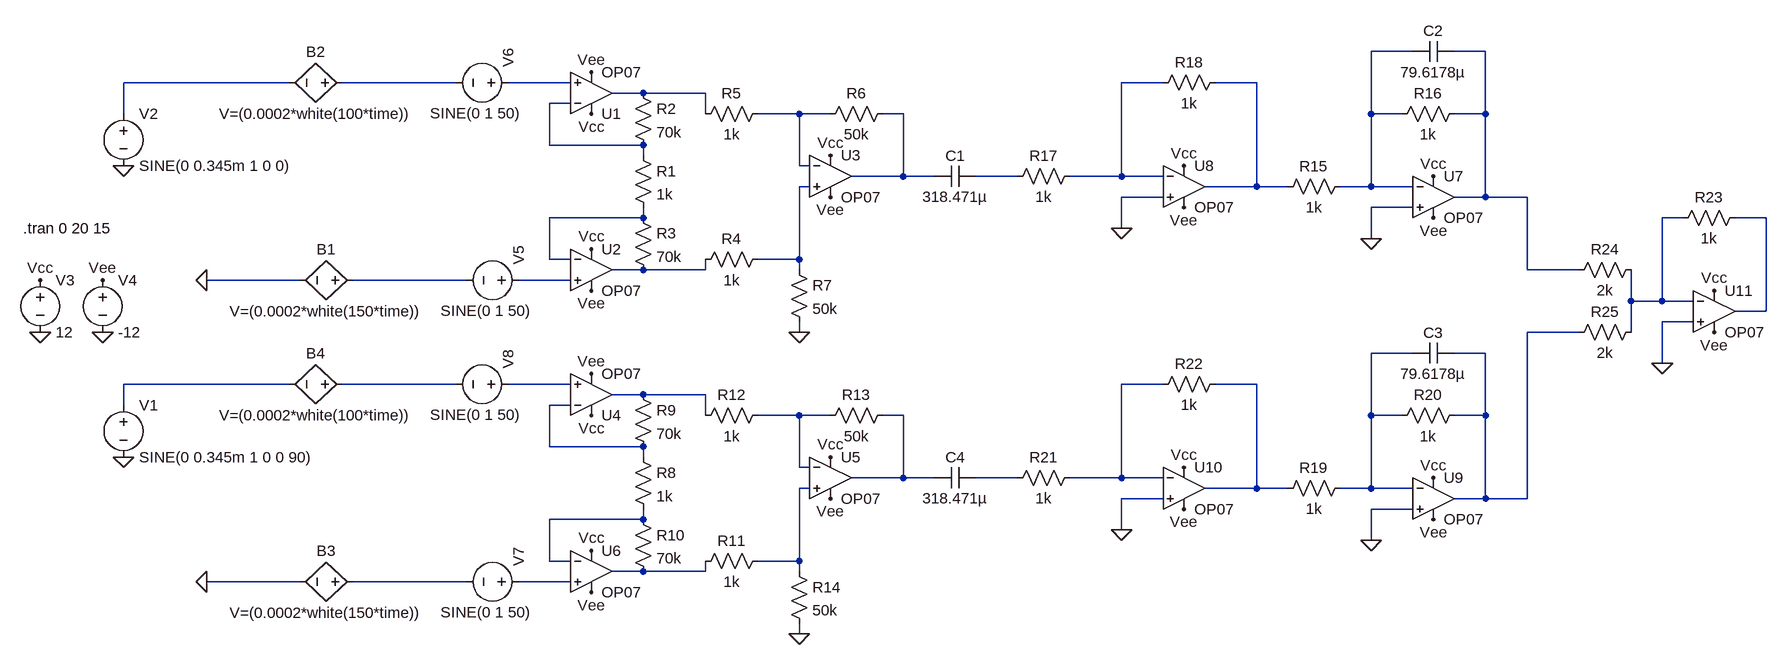
[diagram p0: schematic s&mProject.asc]
s&mProject.asc, the LTspice schematic file:
Version 4
SHEET 1 1908 888
WIRE 1360 -32 1296 -32
WIRE 1472 -32 1424 -32
WIRE -368 16 -624 16
WIRE -112 16 -288 16
WIRE 64 16 -32 16
WIRE 976 16 912 16
WIRE 1120 16 1056 16
WIRE 176 32 128 32
WIRE 272 32 176 32
WIRE 64 48 32 48
WIRE -624 64 -624 16
WIRE 272 64 272 32
WIRE 416 64 352 64
WIRE 464 64 416 64
WIRE 576 64 544 64
WIRE 1296 64 1296 -32
WIRE 1344 64 1296 64
WIRE 1472 64 1472 -32
WIRE 1472 64 1424 64
WIRE 32 112 32 48
WIRE 176 112 32 112
WIRE 176 128 176 112
WIRE 416 144 416 64
WIRE 432 144 416 144
WIRE 576 160 576 64
WIRE 576 160 496 160
WIRE 624 160 576 160
WIRE 752 160 688 160
WIRE 912 160 912 16
WIRE 912 160 832 160
WIRE 976 160 912 160
WIRE 432 176 416 176
WIRE 1120 176 1120 16
WIRE 1120 176 1040 176
WIRE 1168 176 1120 176
WIRE 1296 176 1296 64
WIRE 1296 176 1248 176
WIRE 1360 176 1296 176
WIRE 976 192 912 192
WIRE 1472 192 1472 64
WIRE 1472 192 1424 192
WIRE 1536 192 1472 192
WIRE 1360 208 1296 208
WIRE 176 224 176 208
WIRE 176 224 32 224
WIRE 1776 224 1744 224
WIRE 1904 224 1856 224
WIRE 912 240 912 192
WIRE 1296 256 1296 208
WIRE 32 288 32 224
WIRE 64 288 32 288
WIRE 416 288 416 176
WIRE 416 288 352 288
WIRE 176 304 128 304
WIRE 272 304 272 288
WIRE 272 304 176 304
WIRE 416 304 416 288
WIRE 1536 304 1536 192
WIRE 1616 304 1536 304
WIRE -352 320 -496 320
WIRE -96 320 -272 320
WIRE 64 320 -16 320
WIRE 1696 352 1696 304
WIRE 1744 352 1744 224
WIRE 1744 352 1696 352
WIRE 1792 352 1744 352
WIRE 1904 368 1904 224
WIRE 1904 368 1856 368
WIRE 1792 384 1744 384
WIRE 416 400 416 384
WIRE 1616 400 1536 400
WIRE 1696 400 1696 352
WIRE 1360 432 1296 432
WIRE 1472 432 1424 432
WIRE 1744 448 1744 384
WIRE -368 480 -624 480
WIRE -112 480 -288 480
WIRE 64 480 -32 480
WIRE 976 480 912 480
WIRE 1120 480 1056 480
WIRE 176 496 128 496
WIRE 272 496 176 496
WIRE -624 512 -624 480
WIRE 64 512 32 512
WIRE 272 528 272 496
WIRE 416 528 352 528
WIRE 464 528 416 528
WIRE 576 528 544 528
WIRE 1296 528 1296 432
WIRE 1344 528 1296 528
WIRE 1472 528 1472 432
WIRE 1472 528 1424 528
WIRE 32 576 32 512
WIRE 176 576 32 576
WIRE 176 592 176 576
WIRE 416 608 416 528
WIRE 432 608 416 608
WIRE 576 624 576 528
WIRE 576 624 496 624
WIRE 624 624 576 624
WIRE 752 624 688 624
WIRE 912 624 912 480
WIRE 912 624 832 624
WIRE 976 624 912 624
WIRE 432 640 416 640
WIRE 1120 640 1120 480
WIRE 1120 640 1040 640
WIRE 1168 640 1120 640
WIRE 1296 640 1296 528
WIRE 1296 640 1248 640
WIRE 1360 640 1296 640
WIRE 976 656 912 656
WIRE 1472 656 1472 528
WIRE 1472 656 1424 656
WIRE 1536 656 1536 400
WIRE 1536 656 1472 656
WIRE 1360 672 1296 672
WIRE 176 688 176 672
WIRE 176 688 32 688
WIRE 912 704 912 656
WIRE 1296 720 1296 672
WIRE 32 752 32 688
WIRE 64 752 32 752
WIRE 416 752 416 640
WIRE 416 752 352 752
WIRE 176 768 128 768
WIRE 272 768 272 752
WIRE 272 768 176 768
WIRE 416 768 416 752
WIRE -352 784 -496 784
WIRE -96 784 -272 784
WIRE 64 784 -16 784
WIRE 416 864 416 848
FLAG 416 400 0
FLAG -624 144 0
FLAG 96 272 Vcc
FLAG 96 64 Vcc
FLAG 464 128 Vcc
FLAG 96 0 Vee
FLAG 96 336 Vee
FLAG 464 192 Vee
FLAG -656 400 0
FLAG -752 400 0
FLAG -752 320 Vcc
FLAG -656 320 Vee
FLAG 416 864 0
FLAG -624 592 0
FLAG 96 736 Vcc
FLAG 96 528 Vcc
FLAG 464 592 Vcc
FLAG 96 464 Vee
FLAG 96 800 Vee
FLAG 464 656 Vee
FLAG -496 320 0
FLAG -496 784 0
FLAG 1392 160 Vcc
FLAG 1392 224 Vee
FLAG 1296 256 0
FLAG 1008 144 Vcc
FLAG 1008 208 Vee
FLAG 912 240 0
FLAG 1392 624 Vcc
FLAG 1392 688 Vee
FLAG 1296 720 0
FLAG 1008 608 Vcc
FLAG 1008 672 Vee
FLAG 912 704 0
FLAG 1744 448 0
FLAG 1824 336 Vcc
FLAG 1824 400 Vee
SYMBOL res 160 112 R0
SYMATTR InstName R1
SYMATTR Value 1k
SYMBOL res 160 16 R0
SYMATTR InstName R2
SYMATTR Value 70k
SYMBOL res 160 208 R0
SYMATTR InstName R3
SYMATTR Value 70k
SYMBOL res 368 272 R90
WINDOW 0 0 56 VBottom 2
WINDOW 3 32 56 VTop 2
SYMATTR InstName R4
SYMATTR Value 1k
SYMBOL res 368 48 R90
WINDOW 0 0 56 VBottom 2
WINDOW 3 32 56 VTop 2
SYMATTR InstName R5
SYMATTR Value 1k
SYMBOL res 448 80 R270
WINDOW 0 32 56 VTop 2
WINDOW 3 0 56 VBottom 2
SYMATTR InstName R6
SYMATTR Value 50k
SYMBOL res 400 288 R0
SYMATTR InstName R7
SYMATTR Value 50k
SYMBOL voltage -624 496 R0
WINDOW 123 0 0 Left 0
WINDOW 39 0 0 Left 0
SYMATTR InstName V1
SYMATTR Value SINE(0 0.345m 1 0 0 90)
SYMBOL voltage -624 48 R0
WINDOW 123 0 0 Left 0
WINDOW 39 0 0 Left 0
SYMATTR InstName V2
SYMATTR Value SINE(0 0.345m 1 0 0)
SYMBOL OpAmps\\OP07 96 96 M180
SYMATTR InstName U1
SYMBOL OpAmps\\OP07 464 96 R0
SYMATTR InstName U3
SYMBOL OpAmps\\OP07 96 240 R0
SYMATTR InstName U2
SYMBOL voltage -752 304 R0
WINDOW 123 0 0 Left 0
WINDOW 39 0 0 Left 0
SYMATTR InstName V3
SYMATTR Value 12
SYMBOL voltage -656 304 R0
WINDOW 123 0 0 Left 0
WINDOW 39 0 0 Left 0
SYMATTR InstName V4
SYMATTR Value -12
SYMBOL res 160 576 R0
SYMATTR InstName R8
SYMATTR Value 1k
SYMBOL res 160 480 R0
SYMATTR InstName R9
SYMATTR Value 70k
SYMBOL res 160 672 R0
SYMATTR InstName R10
SYMATTR Value 70k
SYMBOL res 368 736 R90
WINDOW 0 0 56 VBottom 2
WINDOW 3 32 56 VTop 2
SYMATTR InstName R11
SYMATTR Value 1k
SYMBOL res 368 512 R90
WINDOW 0 0 56 VBottom 2
WINDOW 3 32 56 VTop 2
SYMATTR InstName R12
SYMATTR Value 1k
SYMBOL res 448 544 R270
WINDOW 0 32 56 VTop 2
WINDOW 3 0 56 VBottom 2
SYMATTR InstName R13
SYMATTR Value 50k
SYMBOL res 400 752 R0
SYMATTR InstName R14
SYMATTR Value 50k
SYMBOL OpAmps\\OP07 96 560 M180
SYMATTR InstName U4
SYMBOL OpAmps\\OP07 464 560 R0
SYMATTR InstName U5
SYMBOL OpAmps\\OP07 96 704 R0
SYMATTR InstName U6
SYMBOL bv -256 320 R90
WINDOW 0 -32 56 VBottom 2
WINDOW 3 32 56 VTop 2
SYMATTR InstName B1
SYMATTR Value V=(0.0002*white(150*time))
SYMBOL voltage 0 320 M270
WINDOW 3 -47 136 VLeft 2
WINDOW 123 0 0 Left 0
WINDOW 39 0 0 Left 0
SYMATTR InstName V5
SYMATTR Value SINE(0 1 50)
SYMBOL bv -272 16 R90
WINDOW 0 -32 56 VBottom 2
WINDOW 3 32 56 VTop 2
SYMATTR InstName B2
SYMATTR Value V=(0.0002*white(100*time))
SYMBOL voltage -16 16 M270
WINDOW 3 -47 136 VLeft 2
WINDOW 123 0 0 Left 0
WINDOW 39 0 0 Left 0
SYMATTR InstName V6
SYMATTR Value SINE(0 1 50)
SYMBOL bv -256 784 R90
WINDOW 0 -32 56 VBottom 2
WINDOW 3 32 56 VTop 2
SYMATTR InstName B3
SYMATTR Value V=(0.0002*white(150*time))
SYMBOL voltage 0 784 M270
WINDOW 3 -47 136 VLeft 2
WINDOW 123 0 0 Left 0
WINDOW 39 0 0 Left 0
SYMATTR InstName V7
SYMATTR Value SINE(0 1 50)
SYMBOL bv -272 480 R90
WINDOW 0 -32 56 VBottom 2
WINDOW 3 32 56 VTop 2
SYMATTR InstName B4
SYMATTR Value V=(0.0002*white(100*time))
SYMBOL voltage -16 480 M270
WINDOW 3 -47 136 VLeft 2
WINDOW 123 0 0 Left 0
WINDOW 39 0 0 Left 0
SYMATTR InstName V8
SYMATTR Value SINE(0 1 50)
SYMBOL OpAmps\\OP07 1392 128 R0
SYMATTR InstName U7
SYMBOL res 1264 160 R90
WINDOW 0 0 56 VBottom 2
WINDOW 3 32 56 VTop 2
SYMATTR InstName R15
SYMATTR Value 1k
SYMBOL res 1440 48 R90
WINDOW 0 0 56 VBottom 2
WINDOW 3 32 56 VTop 2
SYMATTR InstName R16
SYMATTR Value 1k
SYMBOL cap 1424 -48 R90
WINDOW 0 0 32 VBottom 2
WINDOW 3 32 32 VTop 2
SYMATTR InstName C2
SYMATTR Value 79.6178µ
SYMBOL cap 688 144 R90
WINDOW 0 0 32 VBottom 2
WINDOW 3 32 32 VTop 2
SYMATTR InstName C1
SYMATTR Value 318.471µ
SYMBOL res 848 144 R90
WINDOW 0 0 56 VBottom 2
WINDOW 3 32 56 VTop 2
SYMATTR InstName R17
SYMATTR Value 1k
SYMBOL OpAmps\\OP07 1008 112 R0
SYMATTR InstName U8
SYMBOL res 1072 0 R90
WINDOW 0 0 56 VBottom 2
WINDOW 3 32 56 VTop 2
SYMATTR InstName R18
SYMATTR Value 1k
SYMBOL OpAmps\\OP07 1392 592 R0
SYMATTR InstName U9
SYMBOL res 1264 624 R90
WINDOW 0 0 56 VBottom 2
WINDOW 3 32 56 VTop 2
SYMATTR InstName R19
SYMATTR Value 1k
SYMBOL res 1440 512 R90
WINDOW 0 0 56 VBottom 2
WINDOW 3 32 56 VTop 2
SYMATTR InstName R20
SYMATTR Value 1k
SYMBOL cap 1424 416 R90
WINDOW 0 0 32 VBottom 2
WINDOW 3 32 32 VTop 2
SYMATTR InstName C3
SYMATTR Value 79.6178µ
SYMBOL cap 688 608 R90
WINDOW 0 0 32 VBottom 2
WINDOW 3 32 32 VTop 2
SYMATTR InstName C4
SYMATTR Value 318.471µ
SYMBOL res 848 608 R90
WINDOW 0 0 56 VBottom 2
WINDOW 3 32 56 VTop 2
SYMATTR InstName R21
SYMATTR Value 1k
SYMBOL OpAmps\\OP07 1008 576 R0
SYMATTR InstName U10
SYMBOL res 1072 464 R90
WINDOW 0 0 56 VBottom 2
WINDOW 3 32 56 VTop 2
SYMATTR InstName R22
SYMATTR Value 1k
SYMBOL OpAmps\\OP07 1824 304 R0
SYMATTR InstName U11
SYMBOL res 1872 208 R90
WINDOW 0 0 56 VBottom 2
WINDOW 3 32 56 VTop 2
SYMATTR InstName R23
SYMATTR Value 1k
SYMBOL res 1712 288 R90
WINDOW 0 0 56 VBottom 2
WINDOW 3 32 56 VTop 2
SYMATTR InstName R24
SYMATTR Value 2k
SYMBOL res 1712 384 R90
WINDOW 0 0 56 VBottom 2
WINDOW 3 32 56 VTop 2
SYMATTR InstName R25
SYMATTR Value 2k
TEXT -778 240 Left 2 !.tran 0 20 15

The netlist it stands for:
* s&mProject.asc
R1 N009 N014 1k
R2 N008 N009 70k
R3 N014 N017 70k
R4 N013 N017 1k
R5 N010 N008 1k
R6 N010 N011 50k
R7 N013 0 50k
V1 N022 0 SINE(0 0.345m 1 0 0 90)
V2 N003 0 SINE(0 0.345m 1 0 0)
XU1 N005 N009 Vcc Vee N008 LT1001  ; OP07, pins In+ In- V+ V- OUT
XU3 N013 N010 Vcc Vee N011 LT1001  ; OP07, pins In+ In- V+ V- OUT
XU2 N019 N014 Vcc Vee N017 LT1001  ; OP07, pins In+ In- V+ V- OUT
V3 Vcc 0 12
V4 Vee 0 -12
R8 N028 N033 1k
R9 N027 N028 70k
R10 N033 N034 70k
R11 N032 N034 1k
R12 N029 N027 1k
R13 N029 N030 50k
R14 N032 0 50k
XU4 N024 N028 Vcc Vee N027 LT1001  ; OP07, pins In+ In- V+ V- OUT
XU5 N032 N029 Vcc Vee N030 LT1001  ; OP07, pins In+ In- V+ V- OUT
XU6 N036 N033 Vcc Vee N034 LT1001  ; OP07, pins In+ In- V+ V- OUT
B1 N018 0 V=(0.0002*white(150*time))
V5 N019 N018 SINE(0 1 50)
B2 N004 N003 V=(0.0002*white(100*time))
V6 N005 N004 SINE(0 1 50)
B3 N035 0 V=(0.0002*white(150*time))
V7 N036 N035 SINE(0 1 50)
B4 N023 N022 V=(0.0002*white(100*time))
V8 N024 N023 SINE(0 1 50)
XU7 0 N001 Vcc Vee N002 LT1001  ; OP07, pins In+ In- V+ V- OUT
R15 N001 N007 1k
R16 N002 N001 1k
C2 N002 N001 79.6178µ
C1 N012 N011 318.471µ
R17 N006 N012 1k
XU8 0 N006 Vcc Vee N007 LT1001  ; OP07, pins In+ In- V+ V- OUT
R18 N007 N006 1k
XU9 0 N021 Vcc Vee N020 LT1001  ; OP07, pins In+ In- V+ V- OUT
R19 N021 N026 1k
R20 N020 N021 1k
C3 N020 N021 79.6178µ
C4 N031 N030 318.471µ
R21 N025 N031 1k
XU10 0 N025 Vcc Vee N026 LT1001  ; OP07, pins In+ In- V+ V- OUT
R22 N026 N025 1k
XU11 0 N015 Vcc Vee N016 LT1001  ; OP07, pins In+ In- V+ V- OUT
R23 N016 N015 1k
R24 N015 N002 2k
R25 N015 N020 2k
.tran 0 20 15
.lib LTC.lib
.backanno
.end